# Altium schematic sheet currentU_conditioning.SchDoc
size A4; SheetNumber: 2; SheetTotal: 12; SPICEModelCacheJNOYGZHY: <root> / <DocumentId>JNOYGZHY</DocumentId> / </root>
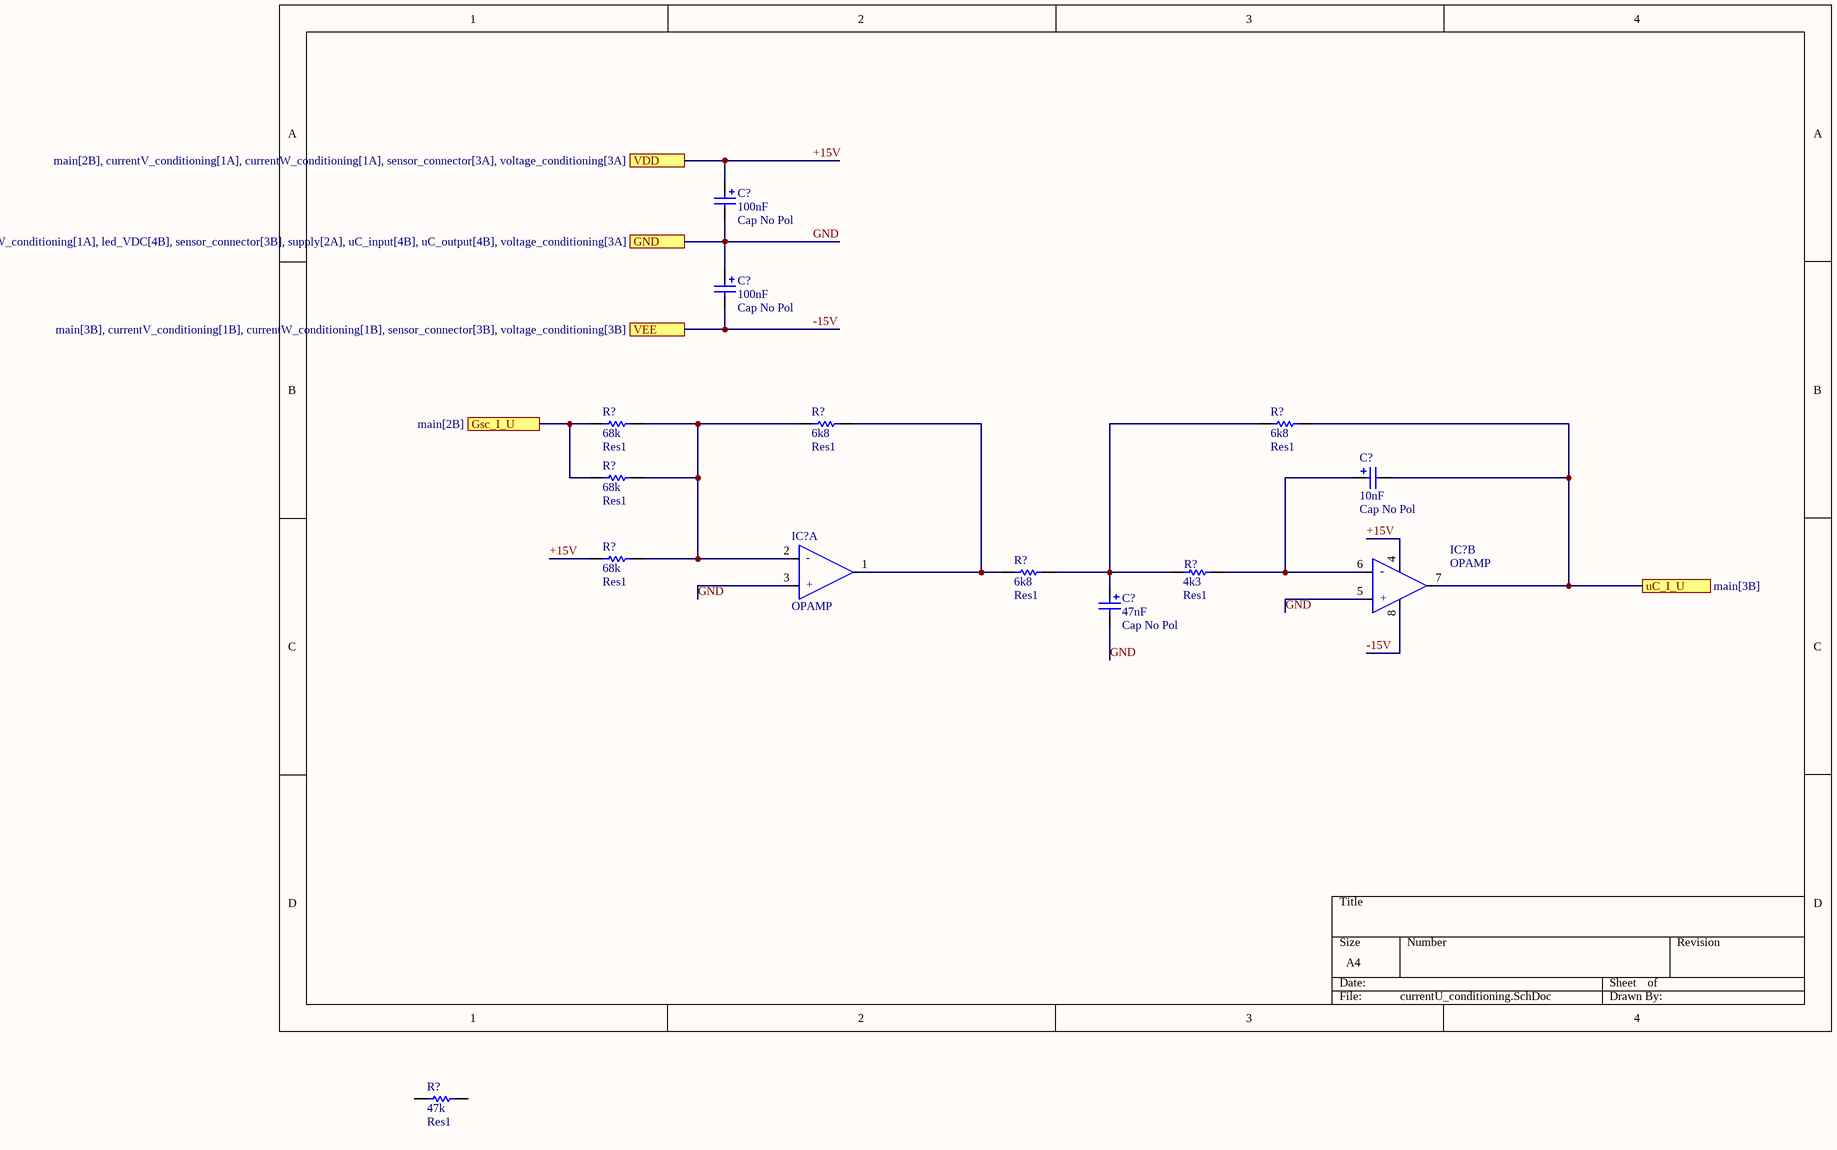
[diagram p0: currentU_conditioning.SchDoc]

## Parts
(Parts that share a designator on the sheet are numbered #1, #2 ... from top to bottom, then left to right.)
C?#1  Cap No Pol  value 100nF  [RAD-0.1]
C?#2  Cap No Pol  value 100nF  [RAD-0.1]
C?#3  Cap No Pol  value 10nF  [RAD-0.1]
C?#4  Cap No Pol  value 47nF  [RAD-0.1]
IC?#1  OPAMP  [DIP-8]  (part A of 2)
IC?#2  OPAMP  [DIP-8]  (part B of 2)
R?#1  Res1  value 68k  [AXIAL-0.3]
R?#2  Res1  value 6k8  [AXIAL-0.3]
R?#3  Res1  value 6k8  [AXIAL-0.3]
R?#4  Res1  value 68k  [AXIAL-0.3]
R?#5  Res1  value 68k  [AXIAL-0.3]
R?#6  Res1  value 6k8  [AXIAL-0.3]
R?#7  Res1  value 4k3  [AXIAL-0.3]
R?#8  Res1  value 47k  [AXIAL-0.3]

## Ports
GND (see main[3B], buffer[2A], control_connector[2D], currentV_conditioning[1A], currentW_conditioning[1A], led_VDC[4B], sensor_connector[3B], supply[2A], uC_input[4B], uC_output[4B], voltage_conditioning[3A]), Gsc_I_U (see main[2B]), uC_I_U (see main[3B]), VDD (see main[2B], currentV_conditioning[1A], currentW_conditioning[1A], sensor_connector[3A], voltage_conditioning[3A]), VEE (see main[3B], currentV_conditioning[1B], currentW_conditioning[1B], sensor_connector[3B], voltage_conditioning[3B])

## Nets
+15V: C?#1.1 IC?#2.4(-V) R?#5.1 ; port VDD
-15V: C?#2.2 IC?#2.8(V+) ; port VEE
GND: C?#1.2 C?#2.1 C?#4.2 IC?#1.3(IN_A_+) IC?#2.5(IN_B_+) ; port GND
Gsc_I_U: R?#1.1 R?#4.1 ; port Gsc_I_U
uC_I_U: C?#3.2 IC?#2.7(OUT_B) R?#3.2 ; port uC_I_U
NetC?#3_1: C?#3.1 IC?#2.6(IN_B_-) R?#7.2
NetC?#4_1: C?#4.1 R?#3.1 R?#6.2 R?#7.1
NetIC?#1_1: IC?#1.1(OUT_A) R?#2.2 R?#6.1
NetIC?#1_2: IC?#1.2(IN_A_-) R?#1.2 R?#2.1 R?#4.2 R?#5.2

Not connected (* = marked no-connect by the designer): R?#8 1 2

## Notes on the sheet
- (in symbol ADTL082, part A) -; +
- (in symbol ADTL082, part B) -; +

## Library data of the parts
C?#1-C?#4 = Cap No Pol: Polarized Capacitor (Radial); Published: 8-Jun-2000; LatestRevisionDate: 17-Jul-2002; LatestRevisionNote: Re-released for DXP Platform.; PackageReference: RB7.6-15; Publisher: Altium Limited; PackageDescription: Polarized Capacitor (Radial); 2 Leads
IC?#1 IC?#2 = ADTL082
R?#1-R?#8 = Res1: Resistor; Published: 8-Jun-2000; LatestRevisionDate: 17-Jul-2002; LatestRevisionNote: Re-released for DXP Platform.; PackageReference: AXIAL-0.3; Publisher: Altium Limited; PackageDescription: Axial Device, Thru-Hole; 2 Leads; 0.3 in Pin Spacing